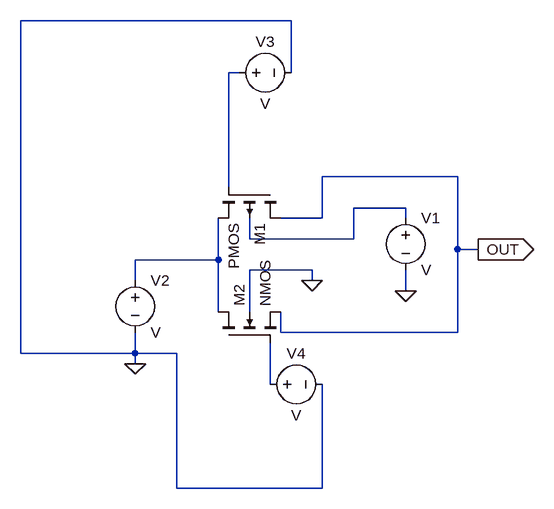
[diagram p0: schematic Draft1.asc]
Draft1.asc, the LTspice schematic file:
Version 4
SHEET 1 880 680
WIRE 304 -160 -112 -160
WIRE 224 -80 208 -80
WIRE 304 -80 304 -160
WIRE 560 80 352 80
WIRE 208 96 208 -80
WIRE 480 128 400 128
WIRE 352 144 352 80
WIRE 352 144 288 144
WIRE 480 144 480 128
WIRE 240 176 240 144
WIRE 400 176 400 128
WIRE 400 176 240 176
WIRE 560 192 560 80
WIRE 592 192 560 192
WIRE 192 208 192 144
WIRE 192 208 64 208
WIRE 336 224 240 224
WIRE 64 240 64 208
WIRE 336 240 336 224
WIRE 480 256 480 224
WIRE 192 288 192 208
WIRE 240 288 240 224
WIRE 288 320 288 288
WIRE 560 320 560 192
WIRE 560 320 288 320
WIRE -112 352 -112 -160
WIRE 64 352 64 320
WIRE 64 352 -112 352
WIRE 128 352 64 352
WIRE 64 368 64 352
WIRE 272 400 272 336
WIRE 128 560 128 352
WIRE 352 560 352 400
WIRE 352 560 128 560
FLAG 336 240 0
FLAG 480 256 0
FLAG 64 368 0
FLAG 592 192 OUT
IOPIN 592 192 Out
SYMBOL pmos4 288 96 R90
SYMATTR InstName M1
SYMBOL nmos4 192 336 R270
SYMATTR InstName M2
SYMBOL voltage 480 128 R0
SYMATTR InstName V1
SYMBOL voltage 64 224 R0
SYMATTR InstName V2
SYMBOL voltage 208 -80 R270
WINDOW 0 32 56 VTop 2
WINDOW 3 -32 56 VBottom 2
SYMATTR InstName V3
SYMBOL voltage 256 400 R270
WINDOW 0 32 56 VTop 2
WINDOW 3 -32 56 VBottom 2
SYMATTR InstName V4

The netlist it stands for:
* Draft1.asc
M1 OUT N001 N003 N002 PMOS
M2 N003 N004 OUT 0 NMOS
V1 N002 0 V
V2 N003 0 V
V3 N001 0 V
V4 N004 0 V
.model NMOS NMOS
.model PMOS PMOS
.lib standard.mos
.backanno
.end